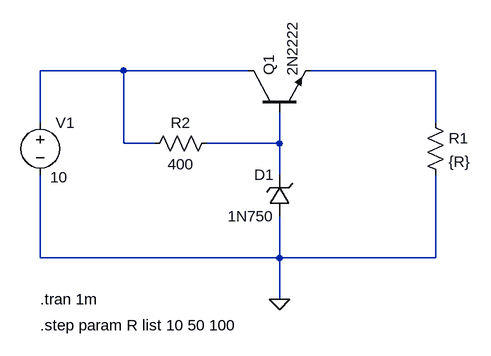
[diagram p0: schematic prof_13_seriese_regurator_zener_diode.asc]
prof_13_seriese_regurator_zener_diode.asc, the LTspice schematic file:
Version 4
SHEET 1 1680 1048
WIRE 944 640 816 640
WIRE 1136 640 944 640
WIRE 1424 640 1232 640
WIRE 816 720 816 640
WIRE 1424 720 1424 640
WIRE 944 752 944 640
WIRE 992 752 944 752
WIRE 1184 752 1184 704
WIRE 1184 752 1072 752
WIRE 1184 800 1184 752
WIRE 816 928 816 800
WIRE 1184 928 1184 864
WIRE 1184 928 816 928
WIRE 1424 928 1424 800
WIRE 1424 928 1184 928
WIRE 1184 992 1184 928
FLAG 1184 992 0
SYMBOL res 1408 704 R0
SYMATTR InstName R1
SYMATTR Value {R}
SYMBOL voltage 816 704 R0
WINDOW 3 15 100 Left 2
SYMATTR Value 10
SYMATTR InstName V1
SYMATTR SpiceLine Rser=0
SYMBOL npn 1136 704 R270
SYMATTR InstName Q1
SYMATTR Value 2N2222
SYMBOL zener 1200 864 R180
WINDOW 0 24 64 Left 2
WINDOW 3 24 0 Left 2
SYMATTR InstName D1
SYMATTR Value 1N750
SYMBOL res 1088 736 R90
WINDOW 0 0 56 VBottom 2
WINDOW 3 32 56 VTop 2
SYMATTR InstName R2
SYMATTR Value 400
TEXT 816 992 Left 2 !.tran 1m
TEXT 816 1032 Left 2 !.step param R list 10 50 100

The netlist it stands for:
* prof_13_seriese_regurator_zener_diode.asc
R1 N002 0 {R}
V1 N001 0 10 Rser=0
Q1 N001 N003 N002 0 2N2222
D1 0 N003 1N750
R2 N003 N001 400
.model D D
.lib standard.dio
.model NPN NPN
.model PNP PNP
.lib standard.bjt
.tran 1m
.step param R list 10 50 100
.backanno
.end